# EAGLE design fonte (EAGLE 9.6.2)
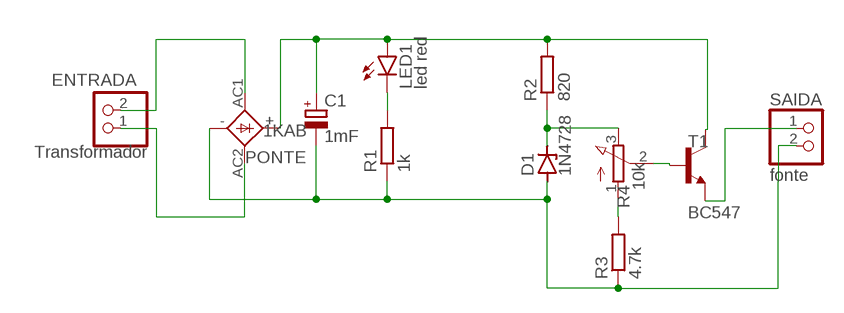
[diagram p0: schematic, sheet 1]

## Parts
C1  1mF  CPOL-EUE5-10.5  [E5-10,5]
D1  1N4728  [DO41Z10]
ENTRADA  Transformador  PINHD-1X2  [1X02]
LED1  led red  LED5MM  [LED5MM]
PONTE  1KAB  [1KAB]
R1  1k  R-EU_0207/10  [0207/10]
R2  820  R-EU_0207/10  [0207/10]
R3  4.7k  R-EU_0207/10  [0207/10]
R4  10k  3RP/1610N  [3RP/1610N]
SAIDA  fonte  PINHD-1X2  [1X02]
T1  BC547  [TO92]

## Nets
N$1: ENTRADA.2 PONTE.AC1
N$2: ENTRADA.1 PONTE.AC2
N$3: C1.- D1.A PONTE.- R1.1 R3.1
N$4: C1.+ LED1.A PONTE.+ R2.2 T1.3(C)
N$5: LED1.K(C) R1.2
N$6: D1.C R2.1 R4.3(E)
N$7: R4.2(S) T1.2(B)
N$8: SAIDA.1 T1.1(E)
N$9: R3.2 R4.1(A)
N$10: SAIDA.2

## Library data of the parts
C1 = rcl:CPOL-EU: POLARIZED CAPACITOR, European symbol; SPICEPREFIX: C
D1 = diode:1N4728: Z DIODE 3.3 V, 1W, 5 percent
ENTRADA SAIDA = pinhead:PINHD-1X2: PIN HEADER
LED1 = led:LED: LED OSRAM: - CHIPLED LG R971, LG N971, LY N971, LG Q971, LY Q971, LO R971, LY R971 LH N974, LH R974 LS Q976, LO Q976, LY Q976 LO Q996 - Hyper CHIPLED LW Q18S LB Q993, LB Q99A, LB R99A - SideLED LS A670, LO A670, LY A670, LG A670, LP A670 LB A673, LV A673, LT A673, LW A673 LH A674 LY A675 LS A676, LA A676, LO A676, LY A676, LW A676 LS A679, LY A679, LG A679 - Hyper Micro SIDELED® LS Y876, LA Y876, LO Y876, LY Y876 LT Y87S - SmartLED LW L88C, LW L88S LB L89C, LB L89S, LG L890 LS L89K, LO L89K, LY L89K LS L896, LA L896, LO L896, LY L896 - TOPLED LS T670, LO T670, LY T670, LG T670, LP T670 LSG T670, LSP T670, LSY T670, LOP T670, LYG T670 LG T671, LOG T671, LSG T671 LB T673, LV T673, LT T673, LW T673 LH T674 LS T676, LA T676, LO T676, LY T676, LB T676, LH T676, LSB T676, LW T676 LB T67C, LV T67C, LT T67C, LS T67K, LO T67K, LY T67K, LW E67C LS E67B, LA E67B, LO E67B, LY E67B, LB E67C, LV E67C, LT E67C LW T67C LS T679, LY T679, LG T679 LS T770, LO T770, LY T770, LG T770, LP T770 LB T773, LV T773, LT T773, LW T773 LH T774 LS E675, LA E675, LY E675, LS T675 LS T776, LA T776, LO T776, LY T776, LB T776 LHGB T686 LT T68C, LB T68C - Hyper Mini TOPLED® LB M676 - Mini TOPLED Santana® LG M470 LS M47K, LO M47K, LY M47K Source: http://www.osram.convergy.de LUXEON: - LUMILED® LXK2-PW12-R00, LXK2-PW12-S00, LXK2-PW14-U00, LXK2-PW14-V00 LXK2-PM12-R00, LXK2-PM12-S00, LXK2-PM14-U00 LXK2-PE12-Q00, LXK2-PE12-R00, LXK2-PE12-S00, LXK2-PE14-T00, LXK2-PE14-U00 LXK2-PB12-K00, LXK2-PB12-L00, LXK2-PB12-M00, LXK2-PB14-N00, LXK2-PB14-P00, LXK2-PB14-Q00 LXK2-PR12-L00, LXK2-PR12-M00, LXK2-PR14-Q00, LXK2-PR14-R00 LXK2-PD12-Q00, LXK2-PD12-R00, LXK2-PD12-S00 LXK2-PH12-R00, LXK2-PH12-S00 LXK2-PL12-P00, LXK2-PL12-Q00, LXK2-PL12-R00 Source: www.luxeon.com KINGBRIGHT: KA-3528ASYC Source: www.kingbright.com
PONTE = rectifier:1KAB: RECTIFIER grid 5,08 x 5,08 mm
R1-R3 = rcl:R-EU_: RESISTOR, European symbol; SPICEPREFIX: R
R4 = pot:3RP/1610N: 16mm Potentiometer one level Source: http://www.alphapotentiometers.net/html/16mm_pot_2.html
T1 = transistor:BC547: NPN TRANSISTOR

## Board
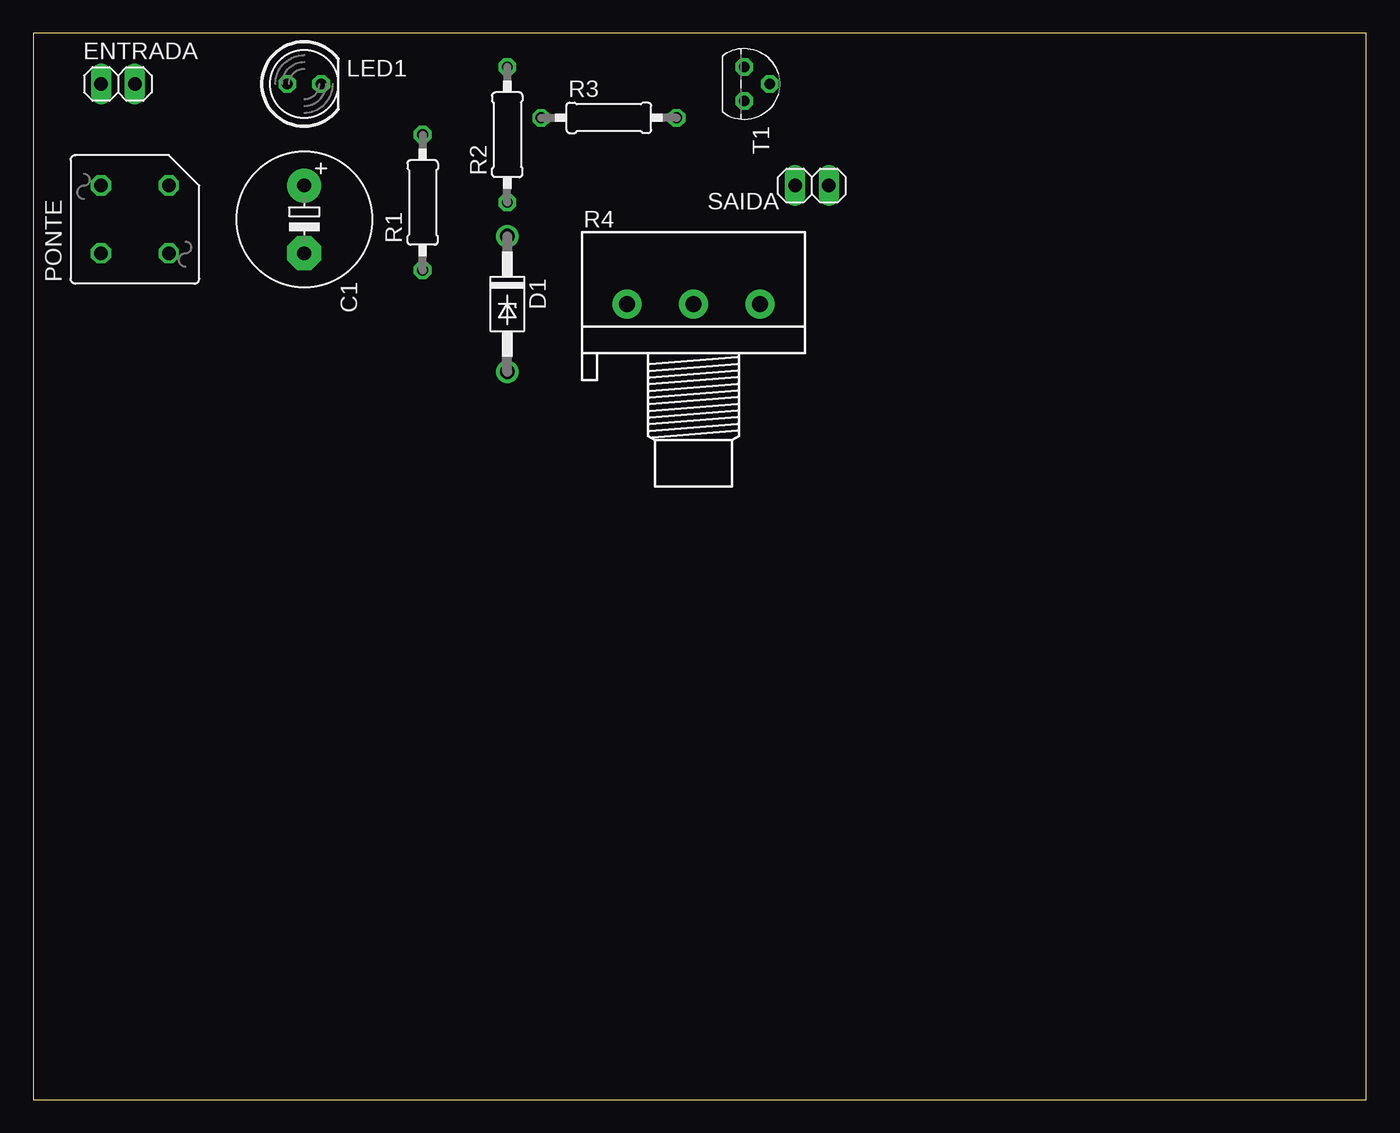
[diagram p1: board, top side]
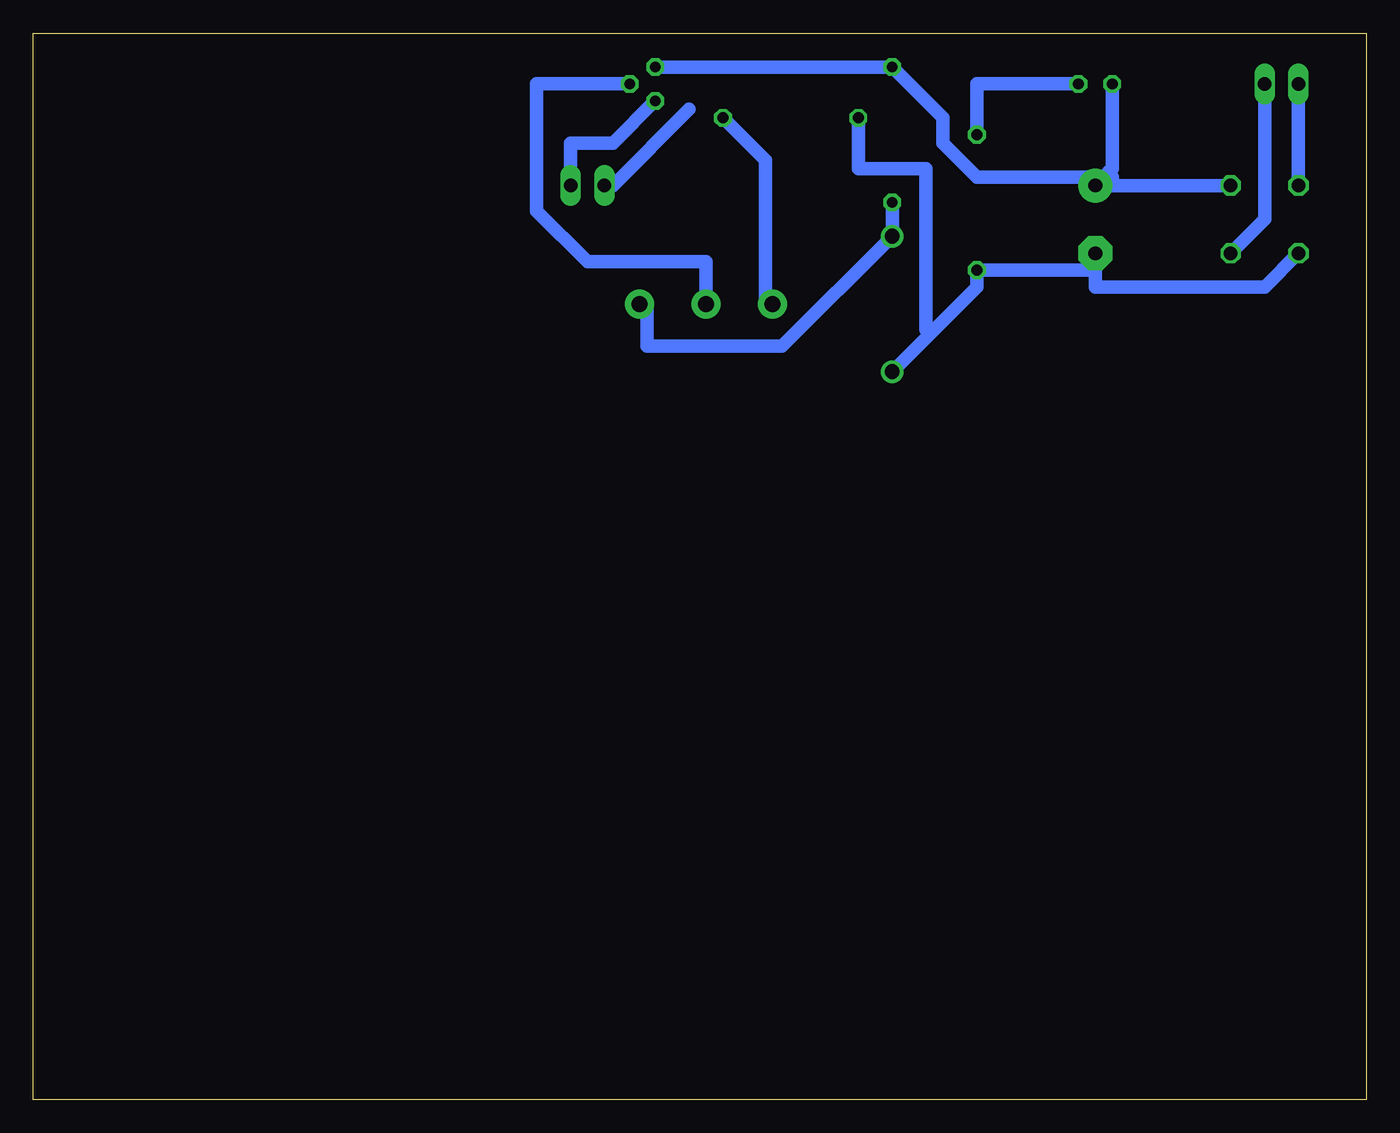
[diagram p2: board, bottom side, seen from below]

Size 100 x 80 mm. Coordinates in mm from the lower left corner, seen from the top.
Outline: 0,0 100,0 100,80 0,80 0,0
Copper layers (1*16): Top 0.035mm / dielectric 1.5mm / Bottom 0.035mm
Design rules "default *": minimum track width 40mil, minimum drill 0.35mm, track to track 40mil, track to pad 40mil, pad to pad 40mil, via to via 40mil, smd to smd 6mil, copper to edge 40mil, drill to drill 6mil, minimum pad ring 10mil, minimum via ring 8mil, stop-mask expansion 4mil, vias tented up to drill 0mil, thermal gap 10mil

### Footprints (pad centres in the part's own frame; a part is rotated, then mirrored left to right if it is on the bottom)
E5-10,5 = drill 1.016 pad 2.54: + -2.54,0 | drill 1.016 pad 2.54 octagon: - 2.54,0
DO41Z10 = drill 1.118: A 5.08,0; C -5.08,0
1X02 = drill 1.016 long: 1 -1.27,0; 2 1.27,0
LED5MM = drill 0.813 octagon: A -1.27,0; K 1.27,0
1KAB = drill 1.016 octagon: + 2.54,-2.54; - -2.54,2.54; AC1 -2.54,-2.54; AC2 2.54,2.54
0207/10 = drill 0.813 octagon: 1 -5.08,0; 2 5.08,0
3RP/1610N = drill 1.2 pad 2.184: 1 -5,0; 2 0,0; 3 5,0
TO92 = drill 0.813 octagon: 1 1.27,0; 2 0,1.905; 3 -1.27,0

### Placement (x,y rotation side)
C1  20.32,66.04 270 top
D1  35.56,59.69 270 top
ENTRADA  6.35,76.2 0 top
LED1  20.32,76.2 0 top
PONTE  7.62,66.04 90 top
R1  29.21,67.31 90 top
R2  35.56,72.39 90 top
R3  43.18,73.66 0 top
R4  49.53,59.69 0 top
SAIDA  58.42,68.58 180 top
T1  53.34,76.2 270 top

### Tracks (layer width: path | path; a pad name or v marks a point on that pad's centre or on a via)
N$1
  Bottom 1.016: PONTE.AC1 7.62,66.04 ENTRADA.2
N$2
  Bottom 1.016: ENTRADA.1 PONTE.AC2
N$3
  Bottom 1.016: R3.1 38.1,69.85 33.02,69.85 33.02,57.78 32.7,57.47 | 20.32,62.23 R1.1 29.21,60.96 32.7,57.47 | C1.- 20.32,62.23 | PONTE.- 7.62,60.96 20.32,60.96 20.32,62.23 | 32.7,57.47 D1.A
N$4
  Bottom 1.016: T1.3 R2.2 31.75,73.66 31.75,71.75 29.21,69.22 20.32,69.22 C1.+ 19.37,69.53 | LED1.A 19.05,69.85 19.37,69.53 | PONTE.+ 19.05,68.58 19.05,69.22 19.37,69.53
N$5
  Bottom 1.016: LED1.K 29.21,76.2 R1.2
N$6
  Bottom 1.016: R2.1 D1.C 43.81,56.52 53.98,56.52 53.98,59.69 R4.3
N$7
  Bottom 1.016: T1.2 62.23,76.2 62.23,66.67 58.42,62.87 49.53,62.87 R4.2
N$8
  Bottom 1.016: T1.1 56.52,71.75 59.69,71.75 SAIDA.1
N$9
  Bottom 1.016: R3.2 45.09,70.48 45.09,59.69 R4.1
N$10
  Bottom 1.016: 50.8,74.3 56.52,68.58 SAIDA.2